# EasyEDA Pro project ProPrj_六无刷——关节电机C_2026-07-28.epro, board PCB1
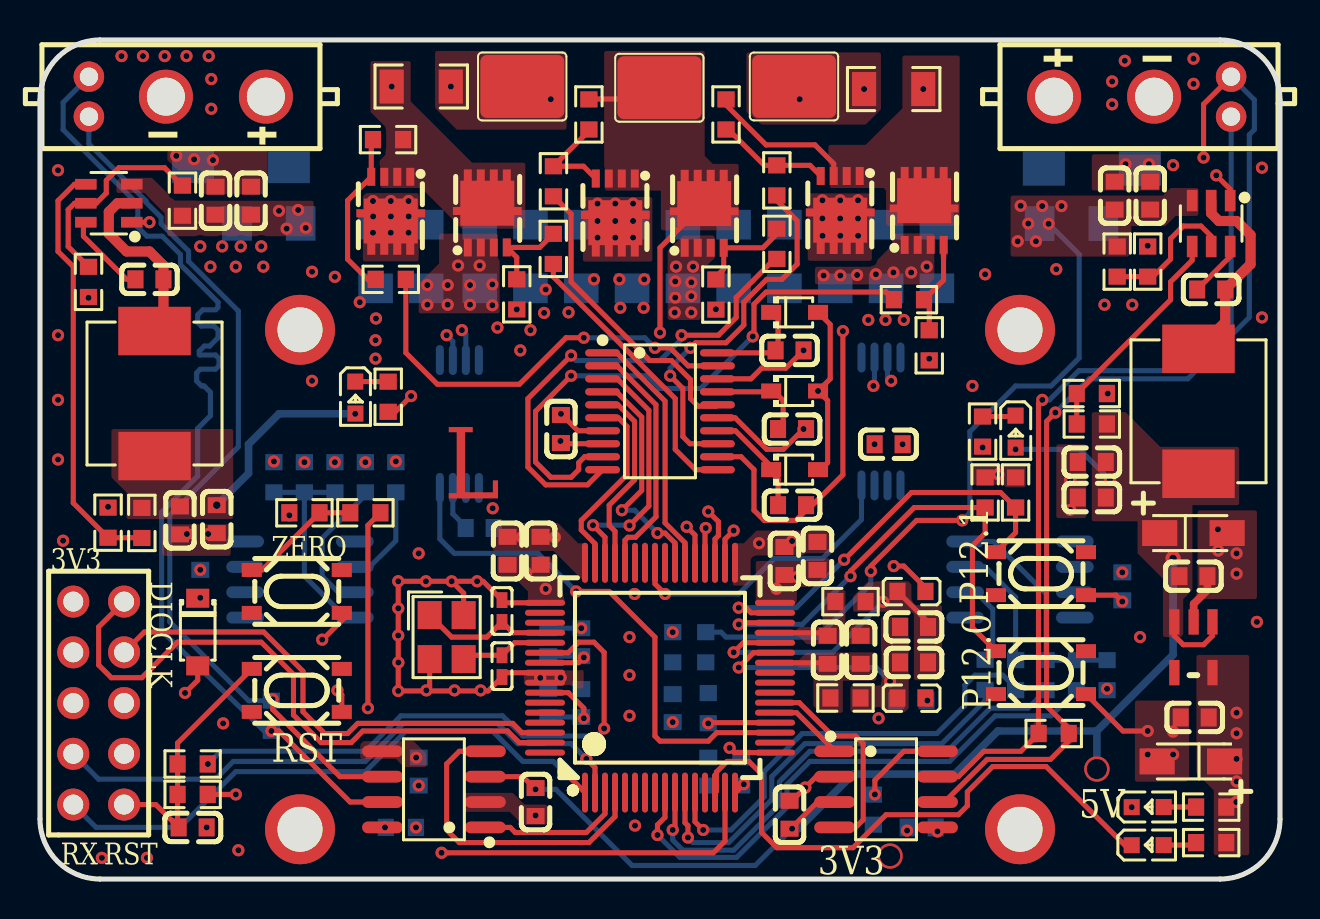
[diagram p1: board, top side]
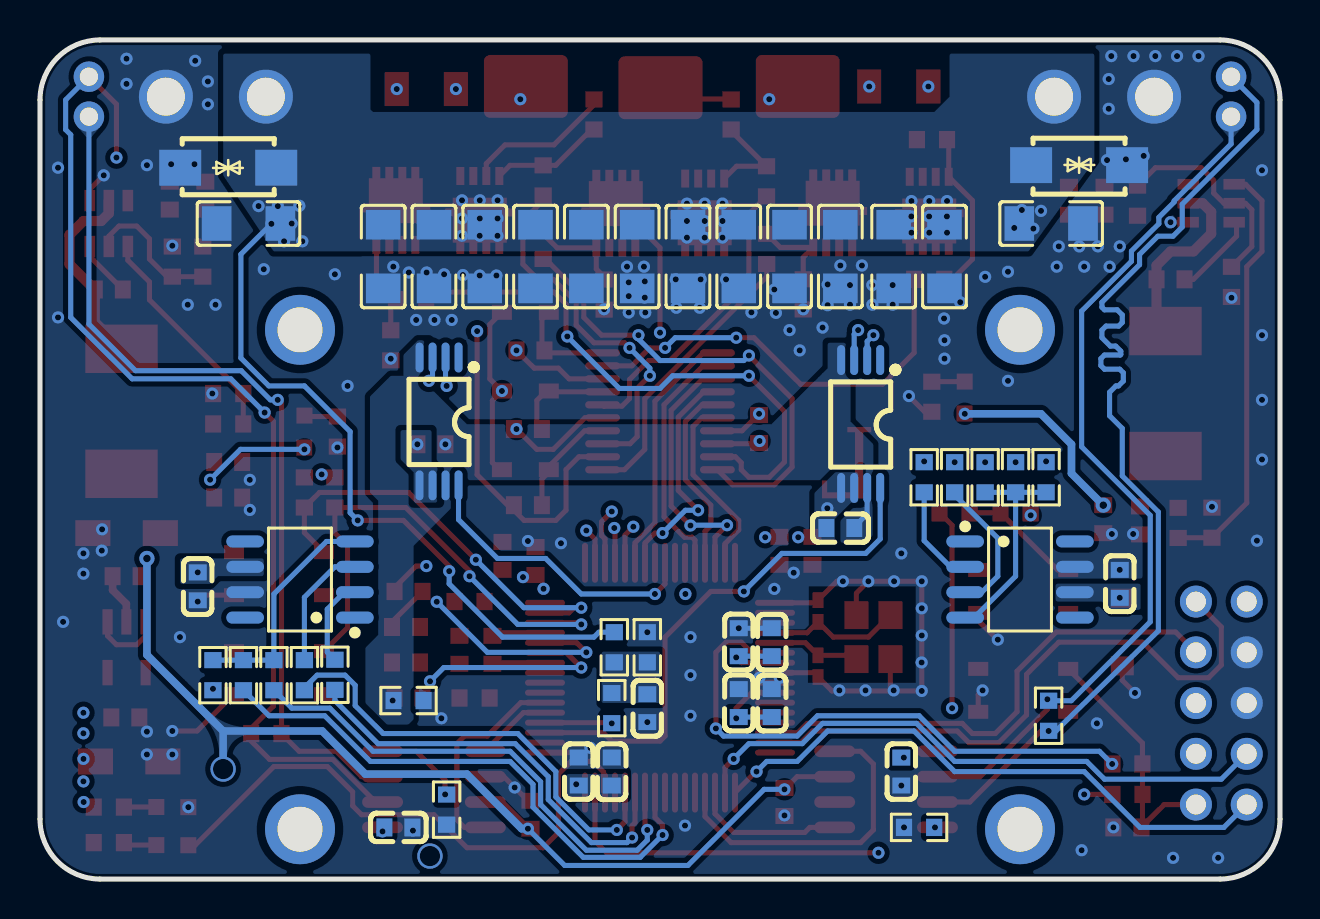
[diagram p2: board, bottom side, seen from below]

Outline 62 x 42 mm; copper layers: Top Layer, Inner1, Inner2, Bottom Layer. Coordinates in mm from the lower left corner of the outline.
Outline path: 0,39 0,3 arc(0.88,0.88) 3,0 59,0 arc(61.12,0.88) 62,3 62,39 arc(61.12,41.12) 59,42 3,42 arc(0.88,41.12) 0,39
Stack: Top Layer 0.035mm 外层铜厚1oz / Dielectric1 0.2104mm 7628 RC49% 8.6mil / Inner1 0.0152mm 内层铜厚 / Dielectric2 1.065mm 1.1mm H/HOZ Copper / Inner2 0.0152mm 内层铜厚 / Dielectric3 0.2104mm 7628 RC49% 8.6mil / Bottom Layer 0.035mm 外层铜厚1oz

## Design rules (mm)
net CAN_H: DP1
net CAN_L: DP1
spacing copperThickness1oz (default): track to track 0.102, other pairs 0.152 to 0.3
spacing copperThickness2oz: track to track 0.203, other pairs 0.152 to 0.3
spacing Plane_innerPlane: track to track 0.102, other pairs 0.152 to 0.3
spacing Copper_copperRegion: track to track 0.102, other pairs 0.152 to 0.3
track width copperThickness1oz (default): min 0.127, default 0.254, max 2.54
track width copperThickness2oz: min 0.203, default 0.254, max 2.54
differential pair differentialPair (default): width min 0.127, default 0.254, max 2.54; gap min 0.152, default 0.152
pour e1008 uses Copper_copperRegion
pour e1010 uses Copper_copperRegion
pour e1014 uses Copper_copperRegion
pour e1016 uses Copper_copperRegion
pour e1021 uses Copper_copperRegion
pour e1023 uses Copper_copperRegion
pour e1025 uses Copper_copperRegion
pour e1027 uses Copper_copperRegion
pour e1029 uses Copper_copperRegion
pour e1031 uses Copper_copperRegion
pour e1033 uses Copper_copperRegion
pour e1035 uses Copper_copperRegion
pour e1037 uses Copper_copperRegion
pour e1039 uses Copper_copperRegion
pour e1042 uses Copper_copperRegion
pour e1044 uses Copper_copperRegion
pour e1046 uses Copper_copperRegion
pour e1048 uses Copper_copperRegion
pour e1050 uses Copper_copperRegion
pour e1052 uses Copper_copperRegion
pour e1054 uses Copper_copperRegion
pour e1056 uses Copper_copperRegion
pour e1058 uses Copper_copperRegion
pour e1060 uses Copper_copperRegion
pour e1062 uses Copper_copperRegion
pour e1064 uses Copper_copperRegion
pour e1066 uses Copper_copperRegion
pour e1068 uses Copper_copperRegion
pour e1070 uses Copper_copperRegion
pour e1072 uses Copper_copperRegion
pour e1074 uses Copper_copperRegion
pour e1076 uses Copper_copperRegion
pour e1078 uses Copper_copperRegion
pour e1080 uses Copper_copperRegion
pour e1082 uses Copper_copperRegion
pour e1084 uses Copper_copperRegion
pour e1086 uses Copper_copperRegion
pour e1088 uses Copper_copperRegion
pour e1090 uses Copper_copperRegion
pour e1092 uses Copper_copperRegion
pour e1094 uses Copper_copperRegion
pour e1096 uses Copper_copperRegion
pour e1098 uses Copper_copperRegion
pour e1100 uses Copper_copperRegion
pour e1102 uses Copper_copperRegion
pour e1104 uses Copper_copperRegion
pour e1106 uses Copper_copperRegion
pour e1108 uses Copper_copperRegion
pour e1110 uses Copper_copperRegion
pour e1112 uses Copper_copperRegion
pour e1114 uses Copper_copperRegion

## Placement (name value [footprint] x y rotation side)
C4  10uF  [C0603]  53.73 34.21 270 top
C5  100nF  [C0603]  55.51 34.21 270 top
C6  100nF  [C0603]  58.56 29.51 0 top
C7  22uF  [C0603]  52.59 19.09 0 top
C8  22uF  [C0603]  52.59 20.87 0 top
C87  4.7uF  [C0603]  43.7 10.84 0 top
C90  2.2uF  [C0603]  41.03 11.47 90 top
C91  10pF  [C0402]  23.1 13.42 90 top
C92  10pF  [C0402]  23.1 10.66 90 top
C93  100nF  [C0603]  31.63 8.55 90 bottom
C94  100nF  [C0603]  33.41 5.38 90 bottom
C95  100nF  [C0603]  7.63 2.58 180 top
C96  4.7uF  [C0603]  35.06 5.38 90 bottom
C97  4.7uF  [C0603]  37.22 15.92 270 top
C98  4.7uF  [C0603]  38.87 16.17 270 top
C99  4.7uF  [C0603]  25.41 11.86 270 bottom
C100  4.7uF  [C0603]  25.41 8.81 270 bottom
C106  100nF  [C0603]  23.38 16.43 90 top
C115  100nF  [C0603]  43.7 12.62 0 top
C116  100nF  [C0603]  39.38 11.47 90 top
C130  22uF  [C0603]  26.05 22.52 270 top
C131  4.7uF  [C0603]  37.48 26.46 180 top
C132  4.7uF  [C0603]  37.6 22.52 180 top
C133  4.7uF  [C0603]  37.6 18.71 180 top
C201  10uF  [CAP-SMD_L3.2-W1.6-RD-C7171]  57.67 17.32 0 top
C202  10uF  [CAP-SMD_L3.2-W1.6-RD-C7171]  57.54 5.89 180 top
C203  100nF  [C0603]  25.03 16.43 90 top
C204  100nF  [C0603]  27.06 11.86 270 bottom
C205  100nF  [C0603]  27.06 8.81 270 bottom
C206  100nF  [C0603]  42.43 21.76 0 top
C207  100nF  [C0603]  21.98 17.57 0 bottom
C210  100nF  [C0603]  37.48 3.22 270 top
C211  100nF  [C0603]  44.08 2.58 180 bottom
C212  100nF  [C0603]  24.78 3.85 90 top
C216  100nF  [C0603]  18.94 5.38 270 bottom
C219  10uF  [C0603]  8.78 33.95 270 top
C220  100nF  [C0603]  10.55 33.95 270 top
C221  22uF  [C0603]  8.84 18.01 90 top
C222  22uF  [C0603]  7 17.95 90 top
C223  100nF  [C0603]  5.47 30.02 0 top
C226  100nF  [C0603]  54.11 14.65 90 bottom
C227  100nF  [C0603]  8.01 14.78 270 bottom
C231  100nF  [C0603]  57.67 15.16 180 top
C232  100nF  [C0603]  57.74 8.09 0 top
C233  22uF  [C1206]  51.57 32.81 180 bottom
C234  22uF  [C1206]  11.44 32.81 0 bottom
C235  22uF  [C1206]  42.3 31.16 90 bottom
C236  22uF  [C1206]  39.76 31.16 90 bottom
C237  22uF  [C1206]  37.22 31.16 90 bottom
C238  22uF  [C1206]  27.06 31.16 90 bottom
C239  22uF  [C1206]  16.78 31.16 90 bottom
C240  22uF  [C1206]  21.98 31.16 90 bottom
C241  22uF  [C1206]  24.52 31.16 90 bottom
C248  22uF  [C1206]  44.84 31.16 90 bottom
C249  22uF  [C1206]  34.68 31.16 90 bottom
C250  22uF  [C1206]  32.14 31.16 90 bottom
C251  22uF  [C1206]  29.6 31.16 90 bottom
C252  22uF  [C1206]  19.32 31.16 90 bottom
CN11  XT30PB(2+2)-M  [CONN-TH_XT30PB-M]  6.87 39.16 180 top
CN12  XT30PB(2+2)-M  [CONN-TH_XT30PB-M]  55.13 39.16 0 top
D50  SMF3.3A  [SOD-123_L2.8-W1.8-LS3.7-RD]  7.89 12.36 270 top
D65  B5819WS-TP  [SOD-323_L1.8-W1.3-LS2.5-RD]  37.73 20.49 0 top
D66  B5819WS-TP  [SOD-323_L1.8-W1.3-LS2.5-RD]  37.73 24.43 0 top
D67  B5819WS-TP  [SOD-323_L1.8-W1.3-LS2.5-RD]  37.73 28.37 0 top
DM2  NCD0603G1  [LED0603-RD]  55.38 3.6 0 top
DM3  NCD0603G1  [LED0603-RD]  55.38 1.7 0 top
DM4  NCD0603G1  [LED0603-RD]  15.77 24.1 270 top
DM5  NCD0603G1  [LED0603-RD]  48.78 22.4 270 top
L1  15uH  [IND-SMD_L7.0-W6.6_FXL0630]  57.92 23.41 90 top
L16  120欧  [L0603]  43.57 14.4 180 top
L17  120欧  [L0603]  43.57 9.06 180 top
L18  15uH  [IND-SMD_L7.0-W6.6_FXL0630]  5.73 24.3 90 top
NOREF  -  [Pad_e293]  49 27.49 0 top
NOREF#2  -  [Pad_e292]  13 27.49 0 top
NOREF#3  -  [Pad_e295]  49 2.49 0 top
NOREF#4  -  [Pad_e294]  13 2.49 0 top
P1  HDR2X5-2.54座  [HDR-TH_10P_C9900008731]  2.93 8.81 90 top
P7  BTC-632-BN02  [CONN-SMD_BTC-632-BN02]  24.12 39.67 0 top
P8  BTC-632-BN02  [CONN-SMD_BTC-632-BN02]  30.97 39.61 0 top
P9  BTC-632-BN02  [CONN-SMD_BTC-632-BN02]  37.71 39.67 0 top
R1  10kΩ  [R0603]  7.63 4.24 180 top
R2  0Ω  [R0603]  40.53 13.89 180 top
R4  100Ω  [R0603]  7.63 5.76 180 top
R5  511kΩ  [R0603]  53.86 30.91 90 top
R6  105kΩ  [R0603]  55.38 30.91 270 top
R7  100kΩ  [R0603]  52.59 22.78 0 top
R8  13.3kΩ  [R0603]  52.59 24.3 180 top
R9  0Ω  [R0603]  40.27 9.06 180 top
R12  1kΩ  [R0603]  58.56 3.6 180 top
R16  4.7Ω  [R0603]  25.67 31.54 90 top
R17  1kΩ  [R0603]  58.56 1.82 180 top
R68  1kΩ  [R0603]  31.63 11.6 270 bottom
R69  10kΩ  [R0603]  33.29 11.6 90 bottom
R70  100Ω  [R0603]  33.41 8.55 270 bottom
R74  150kΩ  [R0603]  5.09 17.82 90 top
R75  13.3kΩ  [R0603]  3.4 17.84 270 top
R98  120Ω  [R0603]  50.69 7.28 180 top
R99  220Ω  [R0603]  41.67 3.47 270 bottom
R122  4.7Ω  [R0603]  36.84 31.79 90 top
R124  4.7Ω  [R0603]  25.67 34.93 90 top
R126  4.7Ω  [R0603]  43.45 29 0 top
R128  4.7Ω  [R0603]  36.84 34.97 90 top
R141  100Ω  [R0603]  16.27 18.33 180 top
R142  4.7kΩ  [R0603]  13.22 18.33 0 top
R143  4.7Ω  [R0603]  17.54 30.02 180 top
R146  120Ω  [R0603]  11.57 8.17 270 bottom
R147  220Ω  [R0603]  18.05 2.58 0 bottom
R156  2mΩ  [R1206]  19.06 39.67 180 top
R157  2mΩ  [R1206]  42.68 39.54 0 top
R158  511kΩ  [R0603]  7.12 33.95 270 top
R159  105kΩ  [R0603]  2.42 29.89 90 top
R160  13.3kΩ  [R0603]  47.13 22.4 90 top
R161  13.3kΩ  [R0603]  17.41 24.14 90 top
R163  100Ω  [R0603]  47.26 10.22 90 bottom
R165  470Ω  [R0603]  50.3 10.2 90 bottom
R166  100Ω  [R0603]  48.78 10.2 90 bottom
R167  470Ω  [R0603]  51.83 10.2 90 bottom
R168  5.1kΩ  [R0603]  53.35 10.2 90 bottom
R169  100Ω  [R0603]  17.79 20.11 270 bottom
R170  470Ω  [R0603]  14.74 20.11 270 bottom
R171  100Ω  [R0603]  16.27 20.11 270 bottom
R172  470Ω  [R0603]  13.22 20.11 270 bottom
R173  5.1kΩ  [R0603]  11.7 20.11 270 bottom
R174  0Ω  [R0603]  43.57 8.93 0 bottom
R176  4.7kΩ  [R0603]  47.26 19.35 90 top
R177  4.7kΩ  [R0603]  48.78 19.35 90 top
R178  10kΩ  [R0603]  17.4 37.01 0 top
R179  10kΩ  [R0603]  23.84 29.27 270 top
R180  10kΩ  [R0603]  33.79 29.25 270 top
R181  10kΩ  [R0603]  27.44 38.27 90 top
R182  10kΩ  [R0603]  34.3 38.27 90 top
R183  10kΩ  [R0603]  44.46 26.71 270 top
SW6  TS3425BA  [SW-SMD_4P-L4.2-W3.2-P2.15-LS4.6-1]  12.84 9.44 0 top
SW7  TS3425BA  [SW-SMD_4P-L4.2-W3.2-P2.15-LS4.6-1]  12.84 14.4 0 top
SW8  TS3425BA  [SW-SMD_4P-L4.2-W3.2-P2.15-LS4.6-1]  50.05 10.33 0 top
SW9  TS3425BA  [SW-SMD_4P-L4.2-W3.2-P2.15-LS4.6-1]  50.05 15.28 0 top
U1  CYT2BL3CAAQ0AZEGST  [LQFP-64_L10.0-W10.0-P0.50-LS12.0-BL]  31 10.08 0 top
U5  TPS54202HDDCR  [SOT-23-6_L2.9-W1.6-P0.95-LS2.8-BL]  58.56 32.81 180 top
U10  RT9013-33GB  [SOT-25]  57.67 11.6 0 top
U28  FD6288T  [TSSOP-20_L6.5-W4.4-P0.65-LS6.4-BL]  31 23.41 270 top
U58  SIT1042AT/3  [SOIC-8_L4.9-W3.9-P1.27-LS6.0-BL]  42.3 4.49 270 top
U59  SIT1042AT/3  [SOIC-8_L4.9-W3.9-P1.27-LS6.0-BL]  19.7 4.49 90 top
U65  INA240A3PWR  [TSSOP-8_L4.4-W3.0-P0.65-LS6.4-BL-2]  20.97 22.78 0 bottom
U66  INA240A3PWR  [TSSOP-8_L4.4-W3.0-P0.65-LS6.4-BL-2]  42.05 22.9 0 bottom
U68  TPS54202HDDCR  [SOT-23-6_L2.9-W1.6-P0.95-LS2.8-BL]  3.44 33.83 90 top
U71  TLE5012BE1000  [PG-DSO-8_L5.0-W4.0-P1.27-LS6.0-BL]  49 14.99 90 bottom
U72  TLE5012BE1000  [PG-DSO-8_L5.0-W4.0-P1.27-LS6.0-BL]  13 14.99 270 bottom
U74  -  [TPN2R703NL改焊盘]  17.54 33.45 180 top
U76  -  [TPN2R703NL改焊盘]  28.76 33.36 180 top
U77  -  [TPN2R703NL改焊盘]  40.01 33.49 180 top
U78  -  [TPN2R703NL改焊盘]  44.21 33.45 0 top
U79  -  [TPN2R703NL改焊盘]  33.21 33.3 0 top
U80  -  [TPN2R703NL改焊盘]  22.36 33.32 0 top
U81  SMAJ28CA  [SMA_L4.3-W2.7-LS5.1-BI]  52.59 35.6 180 bottom
U82  SMAJ28CA  [SMA_L4.3-W2.7-LS5.1-BI]  10.04 35.73 0 bottom
Y1  16MHz  [CRYSTAL-SMD_4P-L3.2-W2.5-BL]  20.33 12.11 270 top

## Footprints (pads in the part's own frame, mm; a bottom-side part is the same pattern mirrored in y, then rotated)
C0402
  rect 0.79x0.54 smd: 1(-0.545,0) 2(0.545,0)
C0603
  rect 0.8x0.9 smd: 1(-0.7,0) 2(0.7,0)
C1206
  rect 1.485x1.728 smd: 1(-1.593,0) 2(1.593,0)
CAP-SMD_L3.2-W1.6-RD-C7171
  rect 1.758x1.296 smd: 1(-1.687,0) 2(1.687,0)
CONN-SMD_BTC-632-BN02
  rrect 4.2x3.15 smd: 1(0,0)
CONN-TH_XT30PB-M
  round 1.524 hole 0.914: 1(4.425,1) 2(4.425,-1)
  round 2.7 hole 1.9: 3(0.575,0) 4(-4.425,0)
CRYSTAL-SMD_4P-L3.2-W2.5-BL
  rect 1.4x1.2 smd: 1(-1.1,-0.85) 2(1.1,-0.85) 3(1.1,0.85) 4(-1.1,0.85)
HDR-TH_10P_C9900008731
  round 1.6 hole 1: 1(-5.08,-1.27) 2(-5.08,1.27) 3(-2.54,-1.27) 4(-2.54,1.27) 5(0,-1.27) 6(0,1.27) 7(2.54,-1.27) 8(2.54,1.27) 9(5.08,-1.27) 10(5.08,1.27)
IND-SMD_L7.0-W6.6_FXL0630
  rect 2.424x3.62 smd: 1(3.128,0) 2(-3.128,0)
L0603
  rect 0.8x0.864 smd: 1(-0.7,0) 2(0.7,0)
LED0603-RD
  rect 0.8x0.8 smd: 1(-0.799,-0.004) 2(0.799,0.004)
LQFP-64_L10.0-W10.0-P0.50-LS12.0-BL
  oval 0.3x2 smd: 1(-3.75,-5.75) 2(-3.25,-5.75) 3(-2.75,-5.75) 4(-2.25,-5.75) 5(-1.75,-5.75) 6(-1.25,-5.75) 7(-0.75,-5.75) 8(-0.25,-5.75) 9(0.25,-5.75) 10(0.75,-5.75) 11(1.25,-5.75) 12(1.75,-5.75) 13(2.25,-5.75) 14(2.75,-5.75) 15(3.25,-5.75) 16(3.75,-5.75) 33(3.75,5.75) 34(3.25,5.75) 35(2.75,5.75) 36(2.25,5.75) 37(1.75,5.75) 38(1.25,5.75) 39(0.75,5.75) 40(0.25,5.75) 41(-0.25,5.75) 42(-0.75,5.75) 43(-1.25,5.75) 44(-1.75,5.75) 45(-2.25,5.75) 46(-2.75,5.75) 47(-3.25,5.75) 48(-3.75,5.75)
  oval 2x0.3 smd: 17(5.75,-3.75) 18(5.75,-3.25) 19(5.75,-2.75) 20(5.75,-2.25) 21(5.75,-1.75) 22(5.75,-1.25) 23(5.75,-0.75) 24(5.75,-0.25) 25(5.75,0.25) 26(5.75,0.75) 27(5.75,1.25) 28(5.75,1.75) 29(5.75,2.25) 30(5.75,2.75) 31(5.75,3.25) 32(5.75,3.75) 49(-5.75,3.75) 50(-5.75,3.25) 51(-5.75,2.75) 52(-5.75,2.25) 53(-5.75,1.75) 54(-5.75,1.25) 55(-5.75,0.75) 56(-5.75,0.25) 57(-5.75,-0.25) 58(-5.75,-0.75) 59(-5.75,-1.25) 60(-5.75,-1.75) 61(-5.75,-2.25) 62(-5.75,-2.75) 63(-5.75,-3.25) 64(-5.75,-3.75)
Pad_e292
  round 3.5 hole 2.25: 1(0,0)
Pad_e293
  round 3.5 hole 2.25: 1(0,0)
Pad_e294
  round 3.5 hole 2.25: 1(0,0)
Pad_e295
  round 3.5 hole 2.25: 1(0,0)
PG-DSO-8_L5.0-W4.0-P1.27-LS6.0-BL
  oval 0.602x1.885 smd: 1(-1.905,-2.743) 2(-0.635,-2.743) 3(0.635,-2.743) 4(1.905,-2.743) 5(1.905,2.743) 6(0.635,2.743) 7(-0.635,2.743) 8(-1.905,2.743)
R0603
  rect 0.806x0.864 smd: 1(-0.753,0) 2(0.753,0)
R1206
  rect 1.208x1.701 smd: 1(-1.479,0) 2(1.479,0)
SMA_L4.3-W2.7-LS5.1-BI
  rect 2.1x1.8 smd: 1(-2.4,0) 2(2.4,0)
SOD-123_L2.8-W1.8-LS3.7-RD
  rect 0.95x1.15 smd: 1(-1.692,0) 2(1.692,0)
SOD-323_L1.8-W1.3-LS2.5-RD
  rect 1x0.75 smd: 1(-1.173,0) 2(1.173,0)
SOIC-8_L4.9-W3.9-P1.27-LS6.0-BL
  oval 0.588x2.045 smd: 1(-1.905,-2.57) 2(-0.635,-2.57) 3(0.635,-2.57) 4(1.905,-2.57) 5(1.905,2.57) 6(0.635,2.57) 7(-0.635,2.57) 8(-1.905,2.57)
SOT-23-6_L2.9-W1.6-P0.95-LS2.8-BL
  rect 0.532x1.072 smd: 1(-0.95,-1.149) 2(0,-1.149) 3(0.95,-1.149) 4(0.95,1.149) 5(0,1.149) 6(-0.95,1.149)
SOT-25
  rect 0.508x1.27 smd: 1(0.953,1.27) 2(0.013,1.27) 3(-0.953,1.27) 4(-0.953,-1.27) 5(0.953,-1.27)
SW-SMD_4P-L4.2-W3.2-P2.15-LS4.6-1
  rect 1x0.7 smd: 1(-2.25,1.075) 2(2.25,1.075) 3(-2.25,-1.075) 4(2.25,-1.075)
TPN2R703NL改焊盘
  rect 0.4x0.9 smd: 1(-0.975,-1.704) 2(-0.325,-1.704) 3(0.325,-1.704) 4(0.975,-1.704)
  rect 0.4x0.6 smd: 5(0.975,1.9) 6(0.325,1.9) 7(-0.325,1.9) 8(-0.975,1.9)
  rect 0.6x0.4 smd: 9(-1.42,0.12) 9(1.42,0.12)
  rect 2.7x2.25 smd: 9(0,0.508)
TSSOP-8_L4.4-W3.0-P0.65-LS6.4-BL-2
  oval 0.4x1.5 smd: 1(-0.975,-3.2) 2(-0.325,-3.2) 3(0.325,-3.2) 4(0.976,-3.2) 5(0.976,3.2) 6(0.325,3.2) 7(-0.325,3.2) 8(-0.975,3.2)
TSSOP-20_L6.5-W4.4-P0.65-LS6.4-BL
  oval 0.364x1.742 smd: 1(-2.925,-2.871) 2(-2.275,-2.871) 3(-1.625,-2.871) 4(-0.975,-2.871) 5(-0.325,-2.871) 6(0.325,-2.871) 7(0.975,-2.871) 8(1.625,-2.871) 9(2.275,-2.871) 10(2.925,-2.871) 11(2.925,2.871) 12(2.275,2.871) 13(1.625,2.871) 14(0.975,2.871) 15(0.325,2.871) 16(-0.325,2.871) 17(-0.975,2.871) 18(-1.625,2.871) 19(-2.275,2.871) 20(-2.925,2.871)

## Nets
As in the schematic, except:
VCC3V3: C94.1 C96.1 C97.2 C98.2 C99.2 C106.2 C202.1 C203.2 C204.2 C206.2 C207.2 C211.1 C216.1 C226.2 C227.2 C232.2 D50.1 L16.1 P1.10 R1.1 R12.1 R17.1 R142.1 R168.1 R173.1 R176.2 R177.2 U1.16 U1.32 U1.48 U1.55 U10.5 U58.5 U59.5 U65.5 U65.6 U66.5 U66.6 U71.6 U72.6

Pads without a net: NOREF 1; NOREF#2 1; NOREF#3 1; NOREF#4 1; P1 3 5; SW6 2 3; SW7 2 3; SW8 2 3; SW9 2 3; U1 5 6 7 8 13 18 23 24 25 40 42 43 50 51 59 60 61 64; U10 4; U65 1; U66 1; U71 1 5 8; U72 1 5 8

## Via types
v1: diameter 0.61, hole 0.305, Top Layer to Bottom Layer, 288 vias
v2: diameter 1.27, hole 1.016, Top Layer to Bottom Layer, 2 vias
v3: diameter 0.762, hole 0.381, Top Layer to Bottom Layer, 2 vias

## Routing (per net, layer and track width the routed paths; a pad name or vN(x,y) marks a point on that pad's centre or on a via; arc(x,y) is an arc through that point)
AGND: length 2.3
  Bottom Layer w0.254: U65.7 20.64,18.28 21.28,17.64 C207.1
  vias: v1(41.73,21.76) v1(44.37,8.93)
GND: length 50.7
  Top Layer w0.254: v1(58.81,35.22) 59.51,34.53 U5.1 ; v1(20.58,14.9) v1(19.3,14.9) v1(17.91,14.9) v1(17.91,13.55) v1(17.91,12.19) v1(17.91,9.42) 22.4,9.42 C92.1 23.32,10.33 U1.56 ; v1(20.58,14.9) v1(21.86,14.9) 22.16,14.9 C91.2 23.23,13.83 U1.49 ; v1(20.58,14.9) 21.18,14.3 Y1.4 ; v1(18.55,24.17) 17.77,23.39 R161.1 ; v1(19.32,9.44) 19.48,9.61 Y1.2 ; SW6.4 15.09,9.22 v1(14.87,9.44) ; v1(7.25,9.32) 7.89,9.95 D50.2 ; U1.17 34.72,6.33 v1(34.48,6.57) ; 37.6,3.92 v1(38.27,4.58) 38.81,5.12 39.99,5.12 ; SW8.4 54.15,7.41 v1(55.38,7.41) ; v1(54.11,13.89) 53.79,14.21 SW9.4 ; v1(14.11,11.98) 14.13,11.98 15.47,13.32 ; C130.2 26.08,21.79 U28.8 ; 4.46,32.88 v1(5.47,32.88)
  Top Layer w0.381: U10.2 57.68,13.77 58.37,14.46 C231.1
  Bottom Layer w0.254: C99.1 v1(27.06,12.56)
  vias: v1(0.9,35.48) v1(0.9,27.22) v1(0.9,23.98) v1(0.9,21) v1(1.16,16.94) v1(2.42,29.09) v1(3.09,1.06) v1(3.4,18.63) v1(4.08,41.19) v1(5.15,41.19) v1(5.35,1.06) v1(6.23,41.19) v1(6.82,36.2) v1(7.32,41.19) v1(7.34,17.27) v1(7.7,36.02) v1(8.01,31.67) v1(8.01,15.48) v1(8.33,2.58) v1(8.44,41.19) v1(8.41,17.27) v1(8.52,30.65) v1(8.56,40.04) v1(8.56,38.56) v1(8.65,35.99) v1(9.11,31.67) v1(9.16,7.79) v1(9.79,30.65) v1(9.92,1.44) v1(10.04,31.67) v1(11.06,31.67) v1(11.16,30.65) v1(13.6,30.4) v1(13.6,24.94) v1(14.74,30.14) v1(15.99,28.87) v1(16.8,28.06) v1(16.78,26.97) v1(16.78,26.05) v1(17.92,10.84) v1(18.8,2.58) v1(18.94,16.3) v1(18.94,4.68) v1(19.37,29.73) v1(19.37,28.75) v1(20.38,29.73) v1(20.38,28.75) v1(20.72,9.44) v1(20.9,30.71) v1(21.5,29.73) v1(21.5,28.75) v1(21.98,30.71) v1(22.03,9.44) v1(22.62,29.76) v1(22.62,28.72) v1(22.87,27.6) v1(23.84,28.51) v1(24.01,26.46) v1(24.32,15.33) v1(24.52,27.48) v1(24.78,3.18) v1(25.01,10.07) v1(25.21,28.34) v1(25.28,29.51) v1(25.28,14.52) v1(26.02,21.92) v1(26.03,10.08) v1(26.43,28.37) v1(27.7,30.02) v1(28.97,30.02) v1(29.02,28.6) v1(29.48,12.11) v1(29.48,10.2) v1(29.48,8.17) v1(29.75,2.68) v1(30.21,30.02) v1(30.18,28.6) v1(31.63,12.36) v1(31.63,7.85) v1(31.74,28.36) v1(31.8,30.65) v1(31.76,29.91) v1(31.76,29.1) v1(32.56,29.87) v1(32.56,29.18) v1(32.56,28.36) v1(32.65,30.65) v1(33.79,28.52) v1(35.95,16.81) v1(37.6,16.92) v1(39.18,30.21) v1(40.02,30.21) v1(40.86,30.23) v1(41.41,27.98) v1(41.79,30.27) v1(41.93,8.05) v1(42.28,27.98) v1(42.67,30.36) v1(43.19,27.98) v1(43.35,2.42) v1(43.56,30.36) v1(44.34,30.65) v1(44.46,26.05) v1(46.62,24.68) v1(47.13,21.6) v1(47.26,30.27) v1(50.81,30.52) v1(51.51,19.98) v1(51.51,18.48) v1(53.22,28.75) v1(53.38,24.3) v1(53.61,39.92) v1(53.61,38.78) v1(54.24,40.96) v1(54.28,35.78) v1(54.61,28.75) v1(54.58,3.6) v1(55,12.11) v1(55.44,35.78) v1(55.38,31.7) v1(55.38,6.23) v1(56.65,35.73) v1(56.66,7.38) v1(56.66,6.23) v1(57.68,41.06) v1(57.68,39.8) v1(58.9,17.5) v1(58.91,16.44) v1(59.83,16.3) v1(59.83,15.28) v1(60.84,12.87) v1(61.1,35.6) v1(61.1,28.11)
VBAT: length 34.8
  Top Layer w0.254: v1(46.11,17.95) 43.83,17.95 41.54,15.67 v1(41.54,15.41)
  Bottom Layer w0.254: R69.2 34.06,12.36 34.3,12.11 38.87,12.11 41.54,14.78 v1(41.54,15.41) ; v1(50.43,32.8) 51.96,31.27 51.96,26.08 50.56,24.68 48.78,24.68 46.49,22.4 46.49,18.33 v1(46.11,17.95)
  vias: v1(11.95,33.45) v1(12.33,32.56) v1(12.91,33.49) v1(13.29,32.59) v1(16.65,33.94) v1(16.65,32.35) v1(16.66,33.17) v1(17.54,33.94) v1(17.54,33.17) v1(17.54,32.35) v1(18.43,33.94) v1(18.43,33.17) v1(18.43,32.35) v1(27.88,33.81) v1(27.88,32.94) v1(27.88,32.11) v1(28.76,33.81) v1(28.76,32.94) v1(28.76,32.11) v1(29.65,33.81) v1(29.65,32.94) v1(29.65,32.11) v1(39.12,33.97) v1(39.12,33.06) v1(39.13,32.2) v1(40.01,33.97) v1(40.01,33.06) v1(40.02,32.2) v1(40.9,33.97) v1(40.9,33.06) v1(40.91,32.2) v1(48.88,31.92) v1(49.03,33.7) v1(49.41,32.81) v1(49.8,31.92) v1(50.11,33.69) v1(51.07,33.69)
VCC1V1: length 4.4
  Top Layer w0.254: U1.58 26.42,9.33 27.19,8.55 v1(27.19,8.05)
  Bottom Layer w0.254: C100.2 C205.2
VCC3V3: length 8.1
  Top Layer w0.254: v1(42.68,15.67) 43.19,15.67 44.27,14.58 L16.1 ; v1(27.19,11.09) 26.92,10.83 U1.55 ; R1.1 v1(9.79,4.24) ; U1.16 34.78,4.33 v1(35.19,4.74)
  Bottom Layer w0.254: C99.2 27.13,11.16 v1(27.19,11.09)
  vias: v1(8.01,14.08) v1(11.7,20.91) v1(12.47,18.21) v1(18.81,6.08) v1(22.63,18.56) v1(24.09,17.11) v1(25.74,17.11) v1(36.82,14.53) v1(37.85,15.11) v1(43.13,21.76) v1(44.87,2.38) v1(47.92,20.25) v1(53.35,9.52) v1(54.11,15.35) v1(59.83,8.32) v1(59.83,7.29) v1(59.83,6.01) v1(59.83,4.89) v1(59.82,3.85) v2(42.5,1.15)
VCC5V: length 59.4
  Top Layer w0.254: U10.1 58.62,12.17 58.18,11.73 57.16,11.73 56.72,12.17 U10.3 ; v1(37.6,2.52) 37.6,2.58 38.87,3.85 39.99,3.85 ; 22.14,5.12 24.14,5.12 v1(24.78,4.49)
  Bottom Layer w0.254: v1(24.78,4.49) 25.79,4.49 29.6,0.68 35.76,0.68 v1(37.6,2.52) ; v1(48.78,21.51) 51.98,21.51 v1(53.5,19.99)
  Bottom Layer w0.381: 52.84,7.41 v2(52.84,5.51) ; 52.84,7.41 47.89,7.41 45.73,5.25 40.65,5.25 37.92,2.52 v1(37.6,2.52) ; 52.84,7.41 56.65,11.22 v3(56.65,16.05)
VCCD7.4V: length 48.1
  Top Layer w0.254: D67.2 39.51,27.76 39.51,25.03 v1(38.9,24.43) 39.38,23.95 39.38,20.84 38.9,20.36 ; U28.7 26.9,22.44 v1(26.05,23.29)
  Inner1 w0.508: v1(15.76,23.29) v1(26.05,23.29) 26.56,23.29 28.84,21 37.99,21 39.01,22.03 39.01,24.32 v1(38.9,24.43)
  Bottom Layer w0.381: v1(15.76,23.29) 11.95,23.29 10.43,21.76 10.43,20.3 v3(8.84,18.71)
VDDA: length 13.2
  Top Layer w0.254: U1.28 35.16,11.83 v1(34.68,11.35) ; C115.2 44.4,12.87 42.87,14.4
  Bottom Layer w0.254: v1(34.68,11.35) 39.63,11.35 v1(42.16,13.88)
VSSA: length 10
  Top Layer w0.254: v1(34.94,10.59) 35.68,11.33 U1.27
  Bottom Layer w0.254: v1(42.5,9.9) 41.81,10.59 v1(34.94,10.59)
ADC0_CH16_P07_0: length 26.6
  Top Layer w0.254: v1(26.81,14.4) 28.46,14.4 30.75,12.11 30.75,7.16 31,6.9 33.41,6.9 33.84,7.33 U1.19
  Bottom Layer w0.254: U65.8 19.99,17.02 20.71,16.3 24.9,16.3 v1(26.81,14.4)
ADC2_CH00_P18_0: length 14.8
  Top Layer w0.254: U1.41 30.75,14.77 v1(31.25,14.27)
  Bottom Layer w0.254: U66.8 41.07,17.99 39.13,16.05 36.72,16.05 34.94,14.27 v1(31.25,14.27)
ADC2_CH01_P18_1:
  vias: v1(29.73,14.27)
BATADC: length 3.4
  Top Layer w0.254: v1(33.41,7.79) 33.45,7.83 U1.20
CAN0_N: length 4
  Top Layer w0.254: U1.21 37.83,8.33 39.76,6.39 39.99,6.39
CAN0_P: length 10.4
  Top Layer w0.254: 39.99,2.58 40.78,2.58 41.16,2.96 41.16,6.78 40.78,7.16 39.64,7.16 37.97,8.83 U1.22
CAN1_N: length 7.7
  Top Layer w0.254: U1.3 28.25,3.26 27.32,2.33 23.76,2.33 23.51,2.58 22.14,2.58
CAN1_P: length 15.8
  Top Layer w0.254: 22.14,6.39 20.97,6.39 20.33,5.76 20.33,2.46 20.97,1.82 27.44,1.82 28.75,3.13 U1.4
CAN_H: length 158.2
  Top Layer w0.254: 44.87,5.12 45.92,5.12 47.19,6.39 49.04,6.39 R98.2 ; U59.7 15.51,3.85 11.95,7.41 v1(11.57,7.41) ; 50.19,7.16 49.92,7.42 49.92,23.79 v1(50.11,23.98)
  Inner1 w0.254: 12.59,37.28 5.33,37.28 2.44,40.16
  Inner1 w0.305: CN12.2 58.65,37.26 49.54,37.26 45.48,41.32 16.65,41.32 12.6,37.27
  Bottom Layer w0.254: CN12.2 59.56,27.78 57.22,25.44 51.94,25.44 50.48,23.98 v1(50.11,23.98) ; v1(11.57,7.41) 11.21,7.41 6.08,12.42 6.08,18.37 7.89,20.18 7.89,22.56 8.52,23.19 8.52,24.37 8.2,24.68 8.08,24.68 7.83,24.93 7.83,25.34 8.01,25.52 8.78,25.52 8.95,25.7 8.95,26.05 8.78,26.23 7.99,26.23 7.96,26.26 7.96,26.42 8.21,26.68 8.48,26.68 8.9,27.1 8.9,27.48 8.7,27.68 8.07,27.68 7.89,27.86 7.89,28.24 8.14,28.49 8.78,28.49 8.9,28.62 8.9,28.87 7.02,30.75 7.02,31.26 6.11,32.18 5.35,32.18 4.89,32.63 4.89,33.78 1.16,37.51 1.16,38.87 2.44,40.16
CAN_L: length 158.2
  Top Layer w0.254: v1(58.18,36.11) 58.18,38.78 CN12.1 ; v1(50.77,23.35) 50.33,22.91 50.33,8.66 51.69,7.29 51.69,7.16 50.52,5.99 47.36,5.99 45.22,3.85 U58.6 ; v1(11.63,9) 11.63,8.49 15,5.12 17.13,5.12
  Inner1 w0.305: 2.44,38.16 2.88,38.16 4.31,36.72 6.48,36.72 6.56,36.81 12.9,36.81 16.9,40.81 45.1,40.81 49.19,36.72 57.77,36.72 58.18,36.32 v1(58.18,36.11)
  Bottom Layer w0.254: CN12.1 60.72,39 60.72,37.51 60.46,37.26 60.46,28.11 57.39,25.04 52.46,25.04 v1(50.77,23.35) ; 2.44,38.16 2.44,36.79 5.3,33.94 5.3,33.88 6.06,33.12 6.06,32.8 7.43,31.43 7.43,30.92 9.92,28.43 9.92,21.63 6.49,18.21 6.49,12.87 10.43,8.93 R146.1 11.57,8.93 v1(11.63,9)
DBG_RX: length 29.3
  Top Layer w0.254: U1.1 26.2,5.38 v1(26.17,5.38)
  Bottom Layer w0.254: P1.2 2.81,2.58 7,2.58 9.79,5.38 16.27,5.38 18.3,7.41 22.62,7.41 24.14,5.89 25.67,5.89 v1(26.17,5.38)
DBG_TX: length 29.9
  Top Layer w0.254: v1(27.32,6.01) 27.75,5.58 U1.2
  Bottom Layer w0.254: P1.4 2.93,5 8.78,5 9.66,5.89 16.27,5.89 18.17,7.79 22.87,7.79 23.89,6.78 26.56,6.78 v1(27.32,6.01)
ECD1_CS: length 22.6
  Top Layer w0.254: v1(33.16,2.46) 32.75,2.87 U1.12
  Bottom Layer w0.254: R166.1 48.78,9.57 48.15,10.2 46.75,10.2 46.24,9.7 46.24,8.68 44.84,7.28 38.11,7.28 36.21,5.38 36.21,4.11 34.56,2.46 v1(33.16,2.46)
ECD1_MISO: length 27.8
  Top Layer w0.254: v1(30.87,2.2) 30.87,2.71 31.25,3.09 U1.9
  Bottom Layer w0.254: R167.1 50.55,8.17 47.76,8.17 45.48,5.89 38.49,5.89 37.35,4.74 37.35,3.6 34.84,1.09 31.99,1.09 v1(30.87,2.2)
ECD1_MOSI: length 25.3
  Top Layer w0.254: v1(31.63,2.46) 31.75,2.57 U1.10
  Bottom Layer w0.254: R165.1 49.41,8.55 47.51,8.55 45.35,6.39 38.49,6.39 36.97,4.87 36.97,3.73 34.68,1.44 32.14,1.44 31.63,1.95 v1(31.63,2.46)
ECD1_SCLK: length 21.4
  Top Layer w0.254: U1.11 32.25,2.82 32.4,2.67 v1(32.4,2.08)
  Bottom Layer w0.254: v1(32.4,2.08) 32.65,1.82 34.43,1.82 36.59,3.98 36.59,5.12 38.24,6.78 45.1,6.78 47.26,8.93 R163.1
ECD2_CS: length 19.4
  Top Layer w0.254: U1.37 32.75,17.22 v1(32.33,17.63)
  Inner1 w0.254: v1(32.33,17.63) 30.87,19.09 24.14,19.09 23,20.24 16.89,20.24 v1(16.27,20.86)
ECD2_MISO: length 25.9
  Top Layer w0.254: U1.34 34.25,17.01 v1(34.68,17.44)
  Inner1 w0.254: v1(34.68,17.44) 34.68,17.95 32.4,20.24 24.78,20.24 23,22.02 14.37,22.02 v1(13.22,20.86)
ECD2_MOSI: length 23.2
  Top Layer w0.254: v1(33.41,18.4) 33.92,17.89 33.92,17.19 33.75,17.02 U1.35
  Inner1 w0.254: v1(33.41,18.4) 33.22,18.4 31.76,19.86 24.52,19.86 22.75,21.63 15.51,21.63 v1(14.74,20.86)
ECD2_SCLK: length 18.6
  Top Layer w0.254: v1(33.29,17.57) 33.25,17.53 U1.36
  Inner1 w0.254: v1(33.29,17.57) 31.38,19.48 24.27,19.48 22.84,20.91 v1(17.79,20.91)
ECO_IN: length 6.8
  Top Layer w0.254: U1.52 23.64,12.33 C91.1 22.34,12.11 20.58,12.11 Y1.1
ECO_OUT: length 4.4
  Top Layer w0.254: U1.53 23.73,11.83 C92.2 21.37,11.2 Y1.3
HOA1: length 21.5
  Top Layer w0.254: U28.19 32.41,25.69 31.51,26.59 v1(30.75,26.59) ; R143.1 18.29,26.34 19.87,24.77 23.97,24.77 26.3,27.1 v1(27.19,27.1)
  Bottom Layer w0.254: v1(30.75,26.59) 30.24,27.1 v1(27.19,27.1)
HOB1: length 15.1
  Top Layer w0.254: R124.1 26.56,33.29 26.56,29.89 30.49,25.95 31.57,25.95 32.52,25 32.52,24.05 32.91,23.67 33.8,23.67 U28.16
HOC1: length 18.3
  Top Layer w0.254: 36.84,33.96 37.86,32.95 37.86,30.78 37.1,30.02 36.33,30.02 35.19,28.87 35.19,27.73 34.3,26.84 32.78,26.84 v1(32.52,26.59) ; U28.13 32.5,21.79 32.14,22.14 32.14,24.56 v1(31.51,25.19)
  Bottom Layer w0.254: v1(32.52,26.59) 31.51,25.57 v1(31.51,25.19)
KEY_P12.0: length 24.7
  Top Layer w0.254: U1.30 35.02,12.83 v1(34.94,12.74) ; v1(40.53,15.16) 40.53,15.41 43.71,18.6 R176.1 47.26,17.32 46.62,16.68 46.62,12.59 SW8.1
  Bottom Layer w0.254: v1(34.94,12.74) 38.11,12.74 v1(40.53,15.16)
KEY_P12.1: length 21.1
  Top Layer w0.254: SW9.1 48.78,17.34 R177.1 48.03,19.35 43.57,19.35 v1(40.21,15.98) ; U1.31 35.55,13.33 35.3,13.58 v1(34.94,13.58)
  Bottom Layer w0.254: v1(34.94,13.58) 37.81,13.58 v1(40.21,15.98)
KEYMOD: length 37
  Top Layer w0.254: R141.1 16.4,17.71 v1(16.4,8.55) ; U1.15 34.25,1.9 33.67,1.31 20.33,1.31
  Inner1 w0.254: v1(16.4,8.55) 16.4,2.2 17.28,1.31 v1(20.08,1.31)
LEDMOD: length 29.3
  Top Layer w0.254: DM3.1 54.24,1.69 50.3,5.63 47.64,5.63 46.37,4.36 46.37,3.67 45.92,3.22 42.3,3.22 40.65,1.57 36.84,1.57 36.08,2.33 36.08,5.25 35.44,5.89 34.35,5.89 33.82,5.36 33.82,4.4 U1.14
LOA1: length 14.3
  Top Layer w0.254: R16.1 25.67,30.14 31.76,24.05 31.76,21.5 32.78,20.49 U28.11
LOB1: length 24
  Top Layer w0.254: v1(32.08,27.22) 33.92,27.22 34.81,28.11 34.81,29.11 36.48,30.79 36.84,30.79 ; U28.10 27.37,19.73 25.28,19.73 24.4,20.62 24.4,24.05 v1(26.56,26.21)
  Bottom Layer w0.254: v1(32.08,27.22) 32.08,27.03 31,25.95 26.81,25.95 v1(26.56,26.21)
LOC1: length 28.8
  Top Layer w0.254: R126.1 42.31,29.38 36.31,29.38 35.7,28.78 35.7,27.22 v1(35.64,27.16) ; v1(26.56,25.19) 24.78,23.41 24.78,20.87 25.54,20.11 26.56,20.11 26.94,20.49 26.94,20.84 27.23,21.14 U28.9
  Bottom Layer w0.254: v1(26.56,25.19) 30.37,25.19 31,24.56 33.03,24.56 v1(35.64,27.16)
M_U_IN+: length 21.1
  Inner1 w0.254: v1(17.58,39.67) 18.68,39.67 18.94,39.41 18.94,38.53 18.55,38.14 16.27,38.14 14.24,36.11 14.24,31.92 18.68,27.48 20.08,27.48 v1(20.33,27.22)
  Bottom Layer w0.254: v1(20.33,27.22) 20.64,26.91 20.64,26.49
M_U_IN-: length 44.7
  Top Layer w0.254: U28.18 35.55,25.04 36.08,25.57 37.29,25.57 v1(38.18,26.46)
  Inner1 w0.254: v1(20.54,39.67) 19.57,39.67 19.32,39.41 19.32,38.4 18.68,37.76 16.4,37.76 14.62,35.99 14.62,32.05 18.81,27.86 20.71,27.86 v1(21.09,27.48) ; v1(38.18,26.46) 25.6,39.03 v1(25.54,39.03)
  Bottom Layer w0.254: U65.3 21.29,27.28 v1(21.09,27.48)
M_W_IN+: length 30.7
  Top Layer w0.254: U77.3 39.69,35.81 38.75,36.75 36.3,36.75 34.3,38.75 34.3,39.02
  Inner1 w0.254: v1(41.67,24.68) 42.15,24.2 44.74,24.2 46.34,25.8 46.34,35.38 42.94,38.78 42.94,39.29 43.19,39.54 v1(44.16,39.54)
  Bottom Layer w0.254: U66.2 41.72,24.74 v1(41.67,24.68)
M_W_IN-: length 51
  Top Layer w0.254: v1(40.14,27.43) 40.14,20.24 38.37,18.46 38.3,18.46 37.8,17.95 36.21,17.95 35.7,18.46 35.7,20.49 35.05,21.14 U28.12
  Inner1 w0.254: v1(40.14,27.43) 37.99,29.58 v1(37.99,39.03) ; v1(42.56,24.94) 42.94,24.56 44.59,24.56 45.99,25.95 45.99,35.22 42.56,38.65 42.56,39.29 42.3,39.54 v1(41.21,39.54)
  Bottom Layer w0.254: U66.3 42.37,25.12 v1(42.56,24.94)
PWM1AH: length 12.6
  Top Layer w0.254: U28.1 28.84,26.34 31.25,23.92 31.25,17.82 32.25,16.83 U1.38
PWM1AL: length 11.9
  Top Layer w0.254: v1(30.87,17.32) 31.25,17.32 31.75,16.82 U1.39 ; U28.4 28.82,24.39 30.09,23.12 30.09,19.45 v1(29.09,18.46)
  Bottom Layer w0.254: v1(29.09,18.46) 29.73,18.46 v1(30.87,17.32)
PWM1BH: length 12.3
  Top Layer w0.254: U1.44 29.25,16.96 29.39,17.11 29.77,17.11 30.8,18.13 30.8,23.74 28.85,25.69 U28.2
PWM1BL: length 9.7
  Top Layer w0.254: U1.45 28.75,17.41 28.46,17.7 28.46,18.71 29.73,19.98 29.73,22.9 28.9,23.74 U28.5
PWM1CH: length 13.1
  Top Layer w0.254: U28.3 28.87,25.04 30.44,23.46 30.44,18.66 v1(29.48,17.7) ; U1.46 28.25,17.11 v1(27.65,17.71)
  Bottom Layer w0.254: v1(27.65,17.71) 29.23,17.71 29.25,17.7 v1(29.48,17.7)
PWM1CL: length 9.5
  Top Layer w0.254: U28.6 28.91,23.09 29.35,22.65 29.35,20.24 27.06,17.95 27.06,17.47 27.75,16.78 U1.47
RST: length 12.6
  Top Layer w0.254: P1.1 5.79,3.73 6.88,2.64 ; SW6.1 6.88,6.81 R4.2 R1.2 6.88,2.64 ; 6.88,2.64 C95.2
SWCLK: length 25.2
  Top Layer w0.254: P1.7 5.22,12.36 11.19,12.36 13.15,10.4 13.15,8.37 14.24,7.28 15.38,7.28 15.89,7.79 23.63,7.79 24.1,7.33 U1.62
SWDIO: length 30.8
  Top Layer w0.254: P1.9 2.93,12.62 2.93,10.71 3.57,10.08 5.09,10.08 6.87,11.86 11.06,11.86 12.67,10.24 12.67,8.21 14.06,6.83 15.56,6.83 16.14,7.41 23.38,7.41 23.96,6.83 U1.63
VBA1: length 5.1
  Top Layer w0.254: U28.20 36.78,26.34 36.9,26.46 36.9,28.02 D67.1
VBB1: length 4.9
  Top Layer w0.254: 37.16,22.52 37.16,23.96 36.69,24.43 36.64,24.39 U28.17
VBC1: length 5.6
  Top Layer w0.254: 36.9,18.59 36.9,20.02 36.43,20.49 36.43,20.78 34.77,22.44 U28.14
VREFH: length 2.7
  Top Layer w0.254: C116.2 39.23,12.33 U1.29
VREFL: length 2.7
  Top Layer w0.254: C116.1 39.33,10.83 U1.26
VSB1: length 25.8
  Top Layer w0.254: 27.31,39.05 30.5,39.05 30.94,39.48 30.97,39.48 ; U28.15 34.75,23.09 36.33,21.51 37.16,21.51 v1(38.18,22.52) ; U79.9 31,31.6 v1(31,27.35)
  Inner1 w0.254: v1(38.18,22.52) 35.7,22.52 31,27.22 v1(31,27.35)
$1N528: length 7.1
  Top Layer w0.254: R5.1 R6.2 55.65,30.15 56.53,31.03 56.53,32.05 57.16,32.68 58.05,32.68 58.56,32.18 U5.5
$1N530: length 9.8
  Top Layer w0.508: L1.1 59.26,27.88 C6.2 60.53,30.78 60.53,32.24 59.83,32.94 58.94,32.94 58.56,33.32 U5.2
$1N533: length 11.3
  Top Layer w0.254: R7.1 R8.2 56.53,28.99 56.53,29.89 57.61,30.97 U5.4
$1N534: length 2.8
  Top Layer w0.254: C6.1 59.51,31.16 U5.6
$1N2535: length 28.6
  Top Layer w0.254: v1(28.21,7.54) 28.21,11.35 27.7,11.86 26.94,11.86 26.41,11.33 U1.54
  Bottom Layer w0.254: v1(8.39,5.76) 9.03,6.39 16.27,6.39 18.05,8.17 23.13,8.17 24.14,7.16 27.82,7.16 v1(28.21,7.54)
$1N3150: length 1.6
  Top Layer w0.254: DM2.2 57.8,3.6 R12.2
$1N3152: length 1.7
  Top Layer w0.254: DM3.2 57.68,1.7 R17.2
$1N3354: length 6.1
  Top Layer w0.254: SW7.1 11.11,15.47 R142.2 R141.2
$1N11417: length 4.7
  Top Layer w0.254: 45.13,6.39 43.19,6.39 41.74,4.95 v1(41.74,4.24)
$1N11705:
  vias: v1(17.25,2.58)
$1N21195: length 10.4
  Top Layer w0.254: 2.3,30.77 1.41,31.66 1.41,33.5 1.73,33.83 2.81,33.83 3.31,34.33 3.31,34.97 3.95,35.6 6.23,35.6 R158.1
$1N21197: length 9.2
  Top Layer w0.508: 4.46,33.83 3.87,33.83 3.44,33.4 3.44,32.3 4.33,31.41 5.47,31.41 6.17,30.71 C223.2 6.17,27.88 L18.1
$1N21200: length 21.3
  Top Layer w0.254: U68.4 1.72,34.78 0.9,33.95 0.9,31.41 1.66,30.65 1.66,18.82 R75.2 5.08,17.08 R74.1
$1N21201: length 4.2
  Top Layer w0.254: 2.17,32.88 2.17,32.87 2.17,32.18 4.33,30.02 C223.1
$1N29317: length 8.3
  Top Layer w0.254: 16.65,29.75 15.38,31.02 15.38,33.97 U74.4 16.56,36.84 16.4,37.01
$1N29323: length 4.9
  Top Layer w0.254: 27.31,37.54 27.31,37.32 R124.2 27.17,35.68 U76.4
$1N29329: length 5.5
  Top Layer w0.254: 34.56,37.52 34.56,37.38 36.22,35.72 R128.2 38.5,35.72 U77.4
$1N29335: length 4.4
  Top Layer w0.254: R179.1 23.84,31.12 U80.4 24.99,31.61 R16.2
$1N29341: length 4.9
  Top Layer w0.254: 33.54,30.14 33.66,30.02 33.67,30.02 34.19,30.53 U79.4 36.14,31.6 36.84,32.29
$1N29347: length 4.8
  Top Layer w0.254: 45.18,31.72 45.18,29.98 R126.2 44.46,28.74 44.46,27.6 44.34,27.48
$1N29661: length 1.7
  Top Layer w0.254: R160.2 48.73,23.15 DM5.1
$1N29700: length 1.6
  Top Layer w0.254: R161.2 17.41,24.9 DM4.1
$1N33855: length 11.5
  Bottom Layer w0.254: R168.2 R167.2 R165.2 50.3,14.27 47.68,16.9 U71.4
$1N33860: length 6.3
  Bottom Layer w0.254: R166.2 48.78,14.1 47.26,15.63 U71.3
$1N33865: length 4.4
  Bottom Layer w0.254: U71.2 46.79,14.36 47.64,13.51 47.64,11.36 R163.2
$1N34755: length 10.6
  Bottom Layer w0.254: R172.2 R173.2 ; R172.2 13.22,15.16 15.29,13.09 U72.4 ; R172.2 R170.2
$1N34761: length 7.1
  Bottom Layer w0.254: U72.3 14.91,14.36 14.11,15.16 14.11,17.06 16.27,19.22 R171.2
$1N34763: length 5
  Bottom Layer w0.254: R169.2 17.79,16.94 16.48,15.63 U72.2

## Copper pours and planes (outline as drawn; the poured copper is in the pictures)
AGND on Bottom Layer: 43.58,7.73 44.66,7.73 45.73,8.81 45.73,11.58 45.09,12.22 45.09,18.94 45.5,19.35 45.5,24.15 44.46,25.19 43.83,25.19 43.83,26.24 43.1,26.97 42.56,26.97 42.73,26.8 42.73,24.83 40.65,22.76 25.43,22.76 22.62,25.57 22.62,26.84 21.47,26.84 21.47,22.9 20.33,21.76 20.33,16.82 20.59,16.82 20.78,16.84 21.98,16.84 21.98,18.09 21.22,18.84 21.22,19.97 41.41,19.97 41.41,18.59 43.32,16.68 43.32,7.99
GND on Top Layer: 60.84,18.45 60.84,14.01 57.8,14.01 57.8,18.45
GND on Top Layer: 57.46,8.93 57.46,5.01 57.32,4.87 54.75,4.87 54.75,8.93
GND on Top Layer: 42.62,32.32 44.71,32.32 44.72,29.76 38.75,29.76 38.75,30.65 41.53,30.65 42.62,31.74
GND on Top Layer: 6.37,36.56 11.38,36.56 11.38,34.28 8.22,34.28 8.14,34.21 8.14,35.35 8.01,35.48 6.37,35.48
GND on Top Layer: 6.11,17.85 9.54,17.85 9.54,16.17 6.11,16.17
GND on Top Layer: 50.81,21.76 52.31,21.76 52.31,18.07 50.81,18.07
GND on Top Layer: 32.14,32.24 33.79,32.24 33.79,31.13 33.65,30.99 33.62,30.99 33.03,30.4 33.03,27.98 31.38,27.98 31.38,31.48
GND on Top Layer: 19.95,32.3 22.98,32.3 22.98,28.32 18.94,28.32 18.94,29.79 19.95,30.81
GND on Top Layer: 34.56,16.81 35.19,16.81 35.83,17.44 39.49,17.44 39.58,17.35 39.58,16.44 39.34,16.2 35.82,16.2 35.54,15.92 35.54,14.87 35.36,14.69 34.56,14.69
GND on Top Layer: 52.59,36.27 56.02,36.27 56.02,34.46 52.59,34.46
GND on Top Layer: 24.19,10.52 27.19,10.52 27.19,9.53 24.19,9.53
GND on Top Layer: 21.22,4.32 23.64,4.32 24.23,3.73 25.36,3.73 25.36,2.58 24.26,2.58 23.49,3.36 21.22,3.36
GND on Top Layer: 22.86,16.3 25.45,16.3 25.98,15.02 26.3,13.63 24.4,13.63 24.4,14.4 23.77,15.02 22.97,15.02 22.86,15.27
GND on Bottom Layer: 41.07,3.22 43.94,3.22 43.94,2.08 41.07,2.08
GND on Bottom Layer: -1.51,43.1 63,43.1 63,-1.73 -1.51,-1.73
GND on Bottom Layer: 15.47,31.2 45.99,31.2 45.99,27.58 15.47,27.58
GND on Bottom Layer: 32.7,6.9 35.77,6.9 35.77,5.51 32.7,5.51
GND on Bottom Layer: 24.79,10.11 27.77,10.11 27.77,9.1 24.79,9.1
GND on Inner1: -3.04,43.61 64.27,43.61 64.27,-0.59 -3.04,-0.59
GND on Inner2: -2.66,43.48 65.04,43.48 65.04,-2.62 -2.66,-2.62
VBAT on Top Layer: 27.15,34.14 30.62,34.14 30.62,30.91 27.15,30.91
VBAT on Top Layer: 13.68,33.95 13.68,32.18 6.36,32.18 6.36,33.95
VBAT on Top Layer: 38.39,34.32 41.59,34.32 41.59,30.95 38.39,30.95
VBAT on Top Layer: 16.14,34.33 18.94,34.33 18.94,30.92 16.14,30.92
VBAT on Top Layer: 3.82,35.1 5.6,35.1 6.74,33.95 7.84,33.95 7.84,32.51 7.76,32.43 6.36,32.43 6.23,32.56 6.23,33.32 5.22,34.33 3.82,34.33
VBAT on Top Layer: 57.92,34.59 57.92,33.19 56.78,33.19 56.27,32.68 54.57,32.68 54.57,31.33 54.4,31.16 48.53,31.16 48.53,34.21 56.15,34.21 56.53,34.59
VBAT on Bottom Layer: 9.28,41.32 16.52,41.32 16.52,39.16 17.28,38.4 45.35,38.4 45.48,38.53 45.48,41.32 52.84,41.32 52.84,35.23 50.32,31.41 12.57,31.41 9.28,35.96
VCC3V3 on Top Layer: 38.24,15.92 38.37,16.05 39.51,16.05 39.51,15.28 38.84,14.62 37.84,14.62 37.84,13.87 37.55,13.58 35.79,13.58 35.79,15.92
VCC3V3 on Top Layer: 18.68,6.9 19.32,6.27 19.32,5.6 18.2,5.6 17.79,6.01 16.14,6.01 16.01,5.89 16.01,6.9
VCC3V3 on Top Layer: 22.62,17.82 25.9,17.82 26.91,16.81 27.32,16.81 27.44,16.68 27.44,14.9 27.32,14.78 25.67,16.42 22.64,16.42
VCC3V3 on Top Layer: 60.46,11.22 60.46,1.19 58.69,1.19 58.69,4.44 57.82,5.3 57.82,11.22
VCC3V3 on Top Layer: 46.6,20.73 49.29,20.73 49.29,19.6 46.6,19.6
VCC3V3 on Bottom Layer: 32.71,5.37 35.68,5.37 35.68,4.08 32.71,4.08
VCC3V3 on Bottom Layer: 6.96,14.78 11.22,14.78 11.22,13.92 11.19,13.89 8.91,13.89 8.41,13.39 7.61,13.39 7.52,13.48 6.97,13.48 6.97,14.77
VCC3V3 on Bottom Layer: 42.42,22.47 43.97,22.47 43.97,21.01 43.32,20.36 43.32,18.84 42.05,18.84 42.05,20.49 42.31,20.75 42.42,20.75
VCC3V3 on Bottom Layer: 50.81,16.05 55,16.05 55,14.78 53.48,14.78 53.1,15.16 50.81,15.16 50.81,16.05
VCC3V3 on Bottom Layer: 21.09,20.36 22.24,20.36 23.28,19.32 23.28,16.95 22.26,16.95 22.26,18.02 21.44,18.84 20.97,18.84 20.97,20.62 21.09,20.49
VCC3V3 on Inner1: 61.73,2.2 59.96,0.43 22.49,0.43 19.86,3.54 7.64,3.54 0.43,12.71 0.43,15.96 0.52,16.05 5.82,16.05 11.27,21.5 20.98,21.5 23.63,18.84 36.97,18.84 40.66,22.52 48.15,22.52 61.73,8.93
VCC5V on Top Layer: 59.96,21.63 59.96,18.71 57.62,18.71 57.62,14.47 57.16,14.01 57.16,12.24 57.03,12.11 56.15,12.11 56.15,15.03 54.88,16.3 54.88,17.9 52.59,17.9 52.59,23.37 54.28,23.37 56.01,21.63
VCCD7.4V on Top Layer: 3.57,22.52 9.66,22.52 9.66,18.01 4.39,18.01 4.33,17.95 4.33,19.35 3.57,20.11
VDDA on Top Layer: 41.41,14.9 43.57,14.9 43.57,14.01 43.86,13.73 45.1,13.73 45.1,9.95 43.7,9.95 43.7,13.25 43.57,13.38 40.65,13.38 40.65,14.15
VSSA on Top Layer: 40.53,9.7 42.02,9.7 42.05,9.72 42.05,13.13 43.44,13.13 43.44,8.55 43.23,8.34 40.61,8.34 40.53,8.43
M_U_IN+ on Top Layer: 16.52,40.94 18.54,40.94 18.54,38.92 21.6,35.86 24.27,35.86 24.27,32.56 21.09,32.56 19.06,34.59 16.99,34.59 16.98,34.66 16.98,35.96 17.28,36.26 17.28,37.65 16.52,38.4
M_U_IN- on Top Layer: 19.75,41.45 26.33,41.45 26.33,37.53 26.3,37.51 20.83,37.51 19.75,38.59
M_W_IN+ on Top Layer: 43.12,41.22 45.96,41.22 45.99,41.19 45.99,32.7 42.3,32.7 42.3,34.46 42.18,34.59 39.42,34.59 39.42,36.75 41.29,36.75 43.12,38.58
M_W_IN- on Top Layer: 42.05,41.37 42.05,38.53 41.29,37.76 36.08,37.76 35.32,38.4 35.32,41.37
VREFH on Top Layer: 39.14,14.46 40.27,14.46 40.27,12.79 41.65,12.79 41.65,11.76 38.34,11.76 37.99,12.11 35.7,12.11 35.7,12.62 39.14,12.62
VREFL on Top Layer: 35.7,10.97 37.95,10.97 38.33,11.35 41.82,11.35 41.82,9.93 40.14,9.93 40.14,8.31 38.89,8.31 38.67,8.53 38.67,10.38 38.46,10.59 35.7,10.59
VSB1 on Top Layer: 33.24,41.45 33.24,36.2 33.64,35.8 34.87,35.8 34.94,35.73 34.94,32.47 31.05,32.47 31.05,34.43 31.02,34.46 28.21,34.46 28.21,41.45
$1N2819 on Bottom Layer: 31,11.38 33.92,11.38 33.92,8.81 31,8.81

Small or netless copper shapes (teardrops, artwork), in the pictures only: 10 on Top Layer, 8 on Bottom Layer, 3 on Inner1

## Text on the board
Top Layer: L
Top Silkscreen Layer: ZERO | 3V3 | RX | RST | DIO | CLK | 5V | P12.1 | P12.0
